# Altium project ec200u new design.PrjPcb
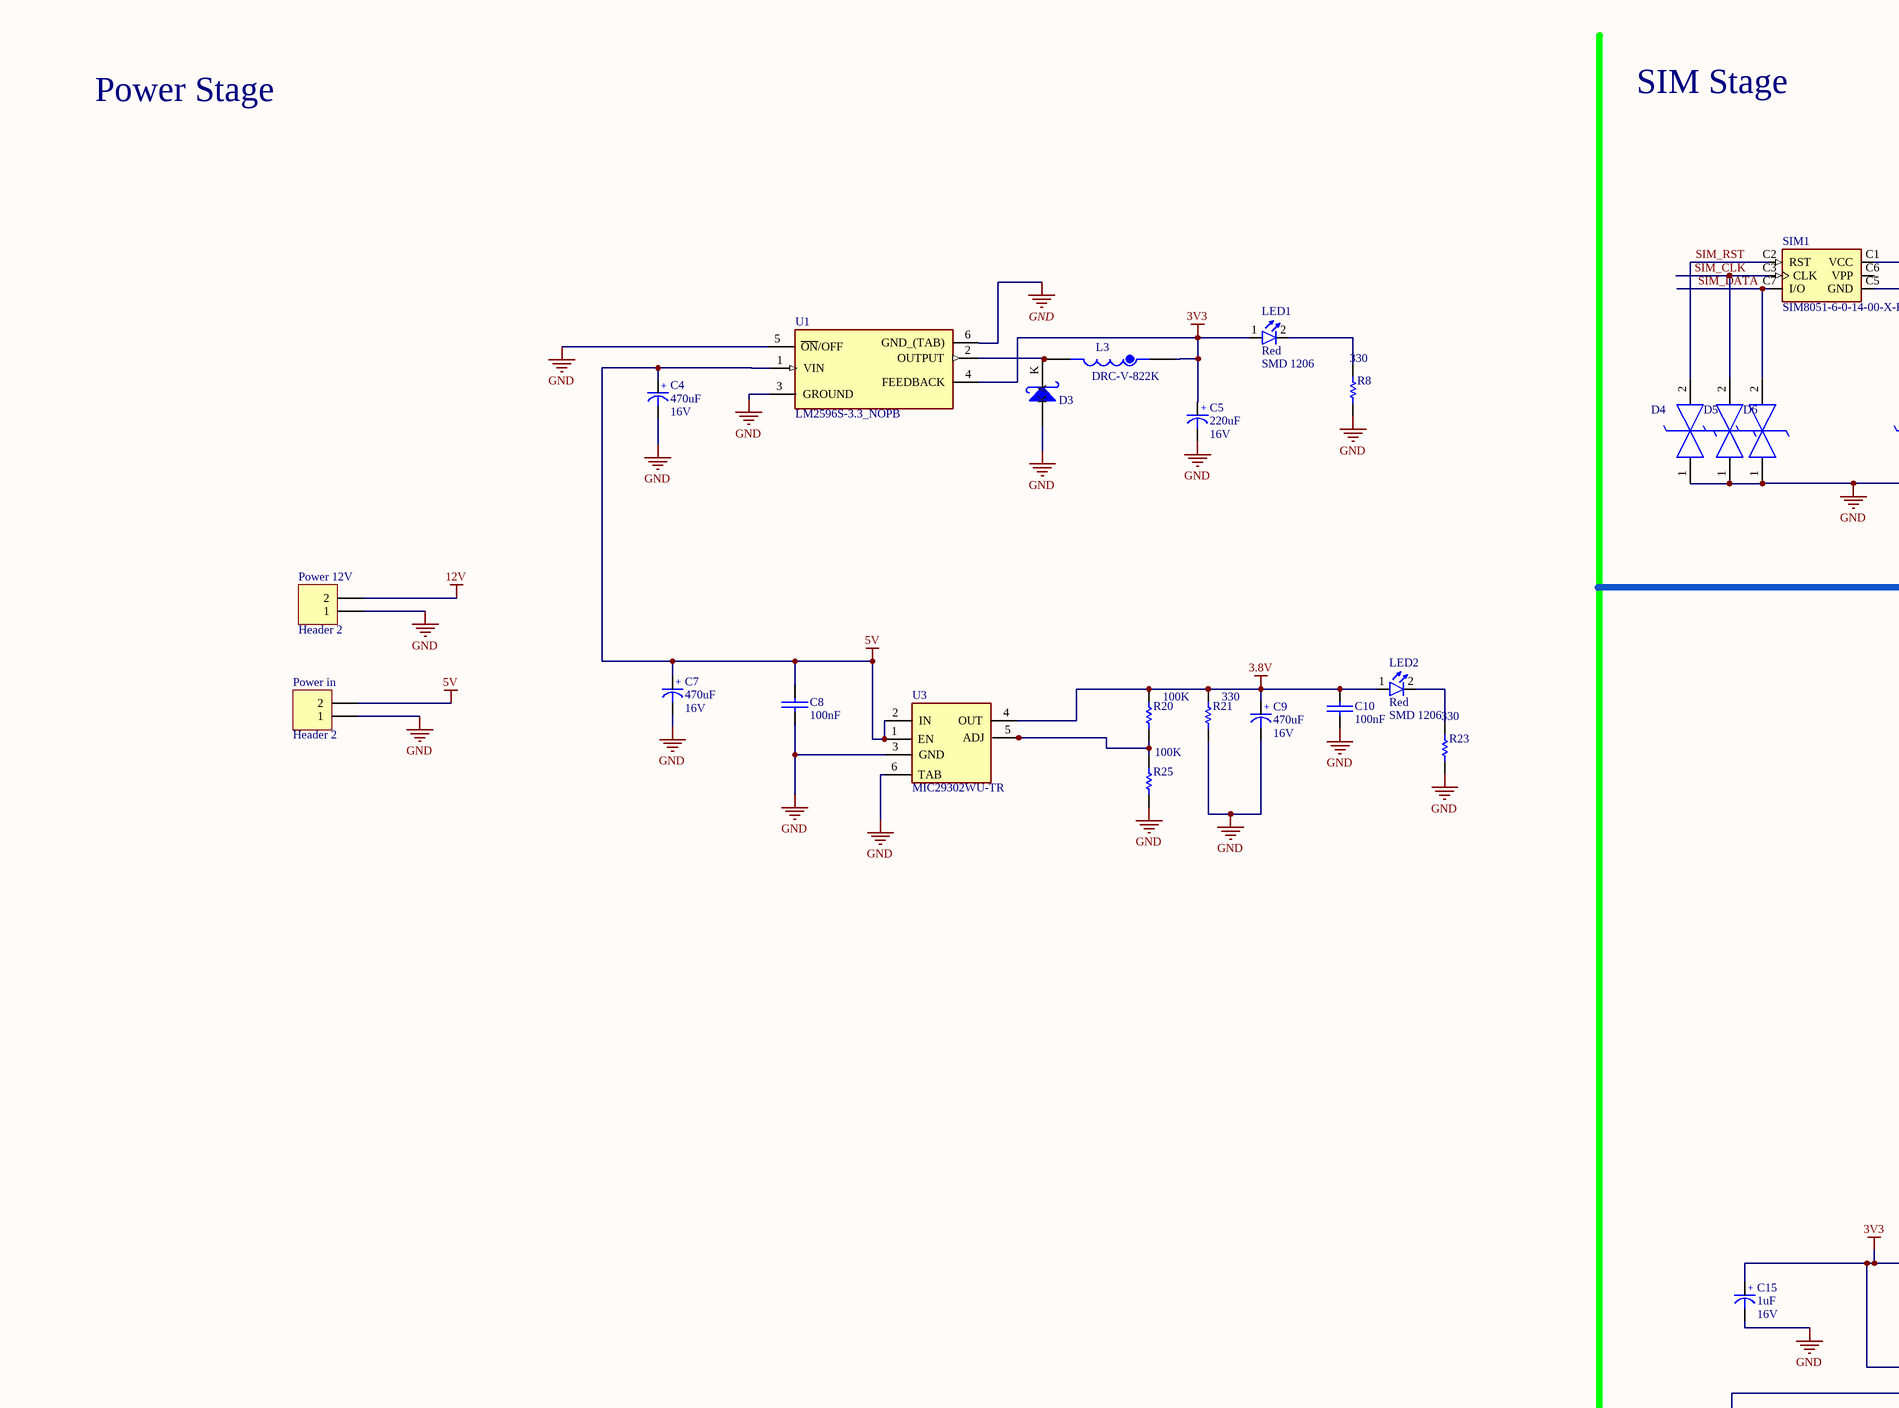
[diagram p0: ec200u main.SchDoc, top left]
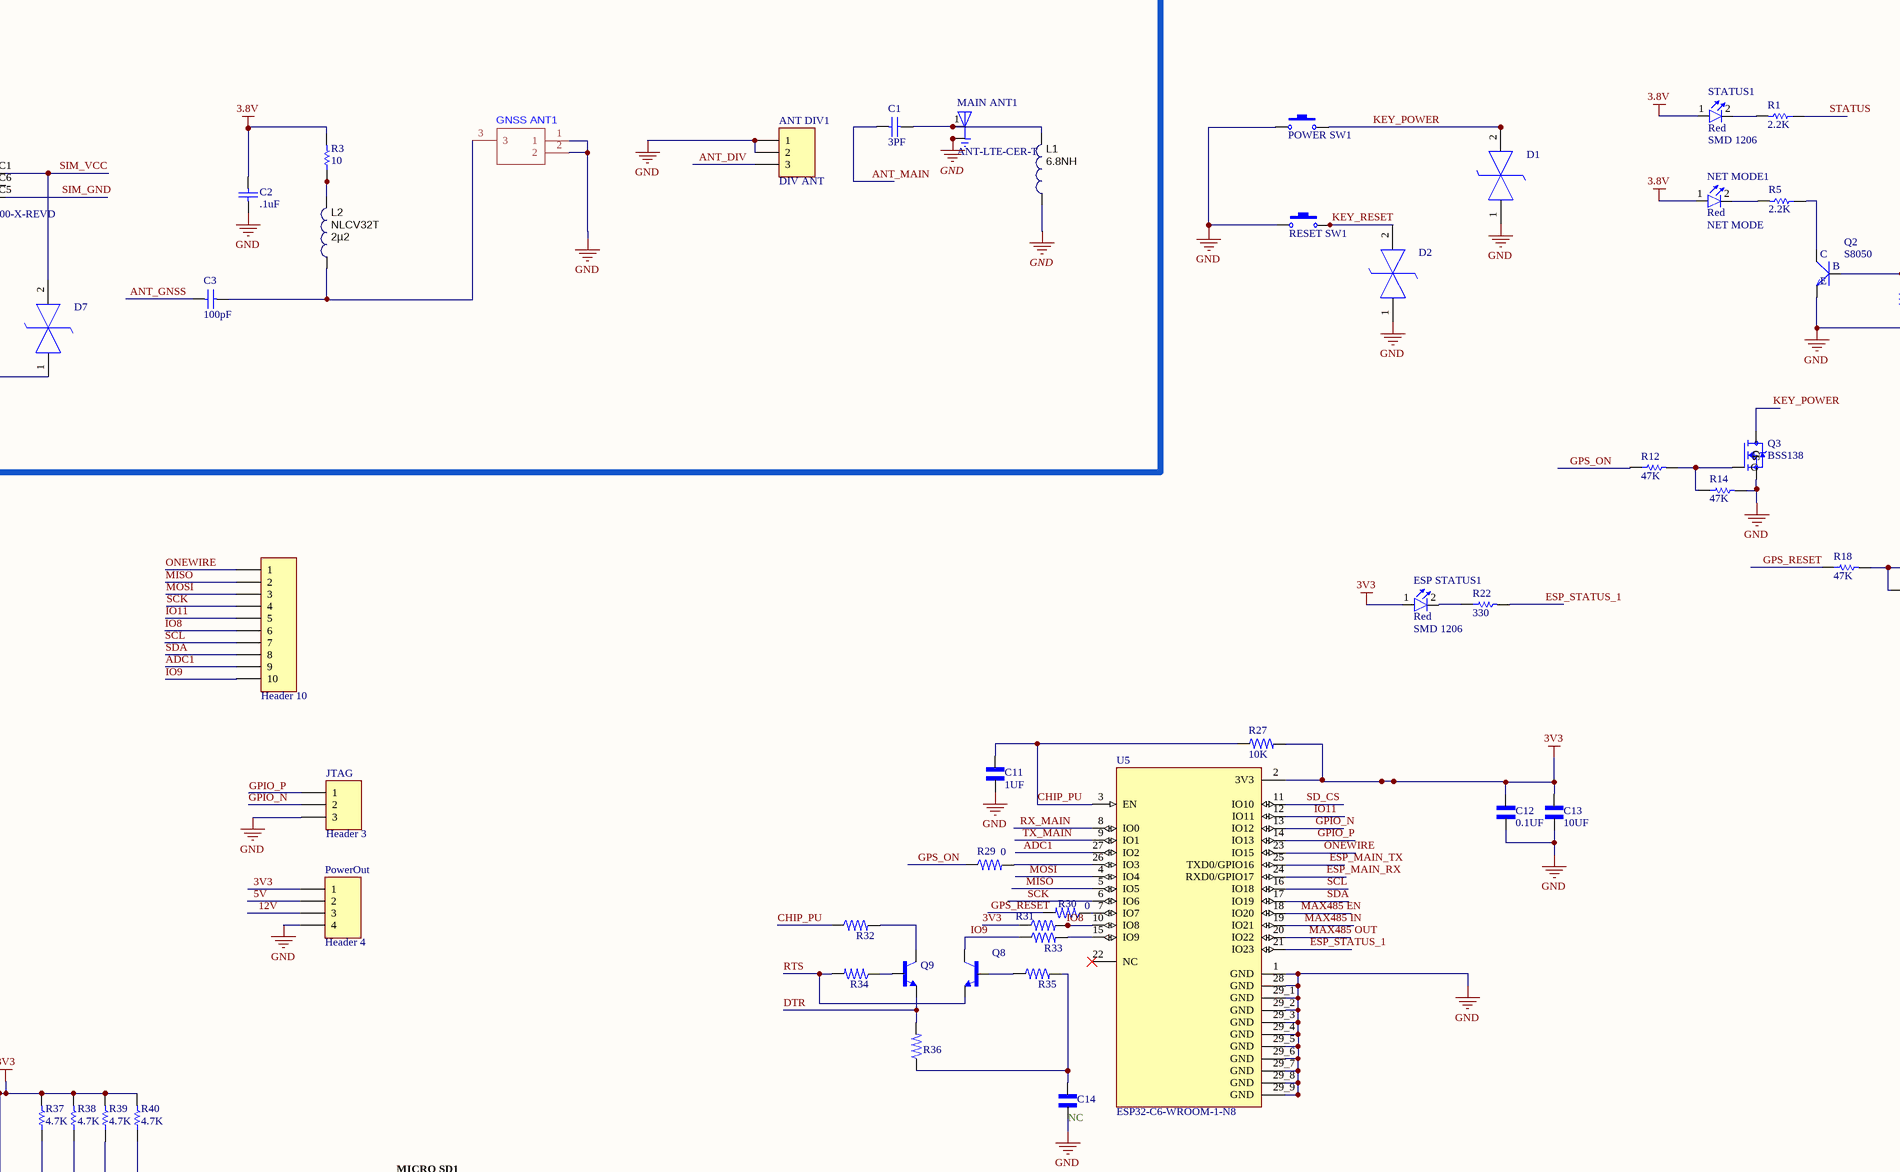
[diagram p1: ec200u main.SchDoc, top middle]
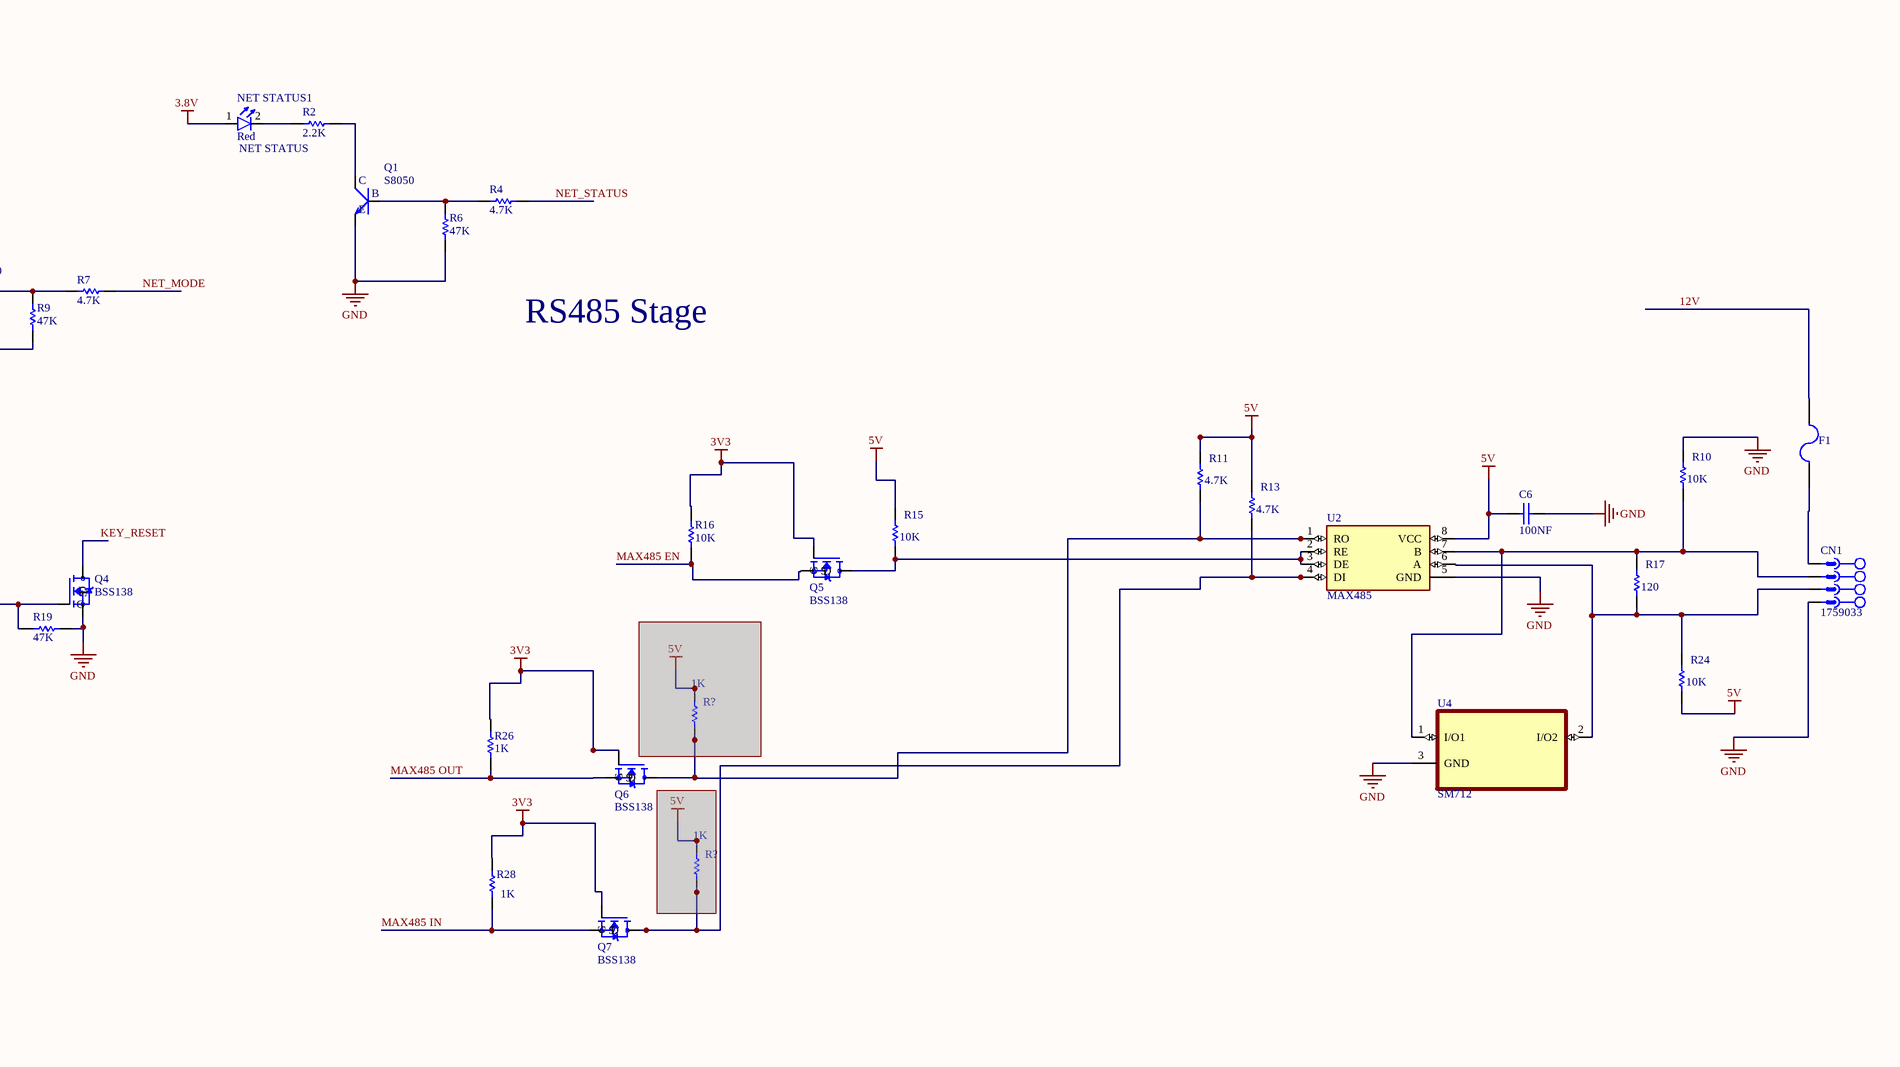
[diagram p2: ec200u main.SchDoc, top right]
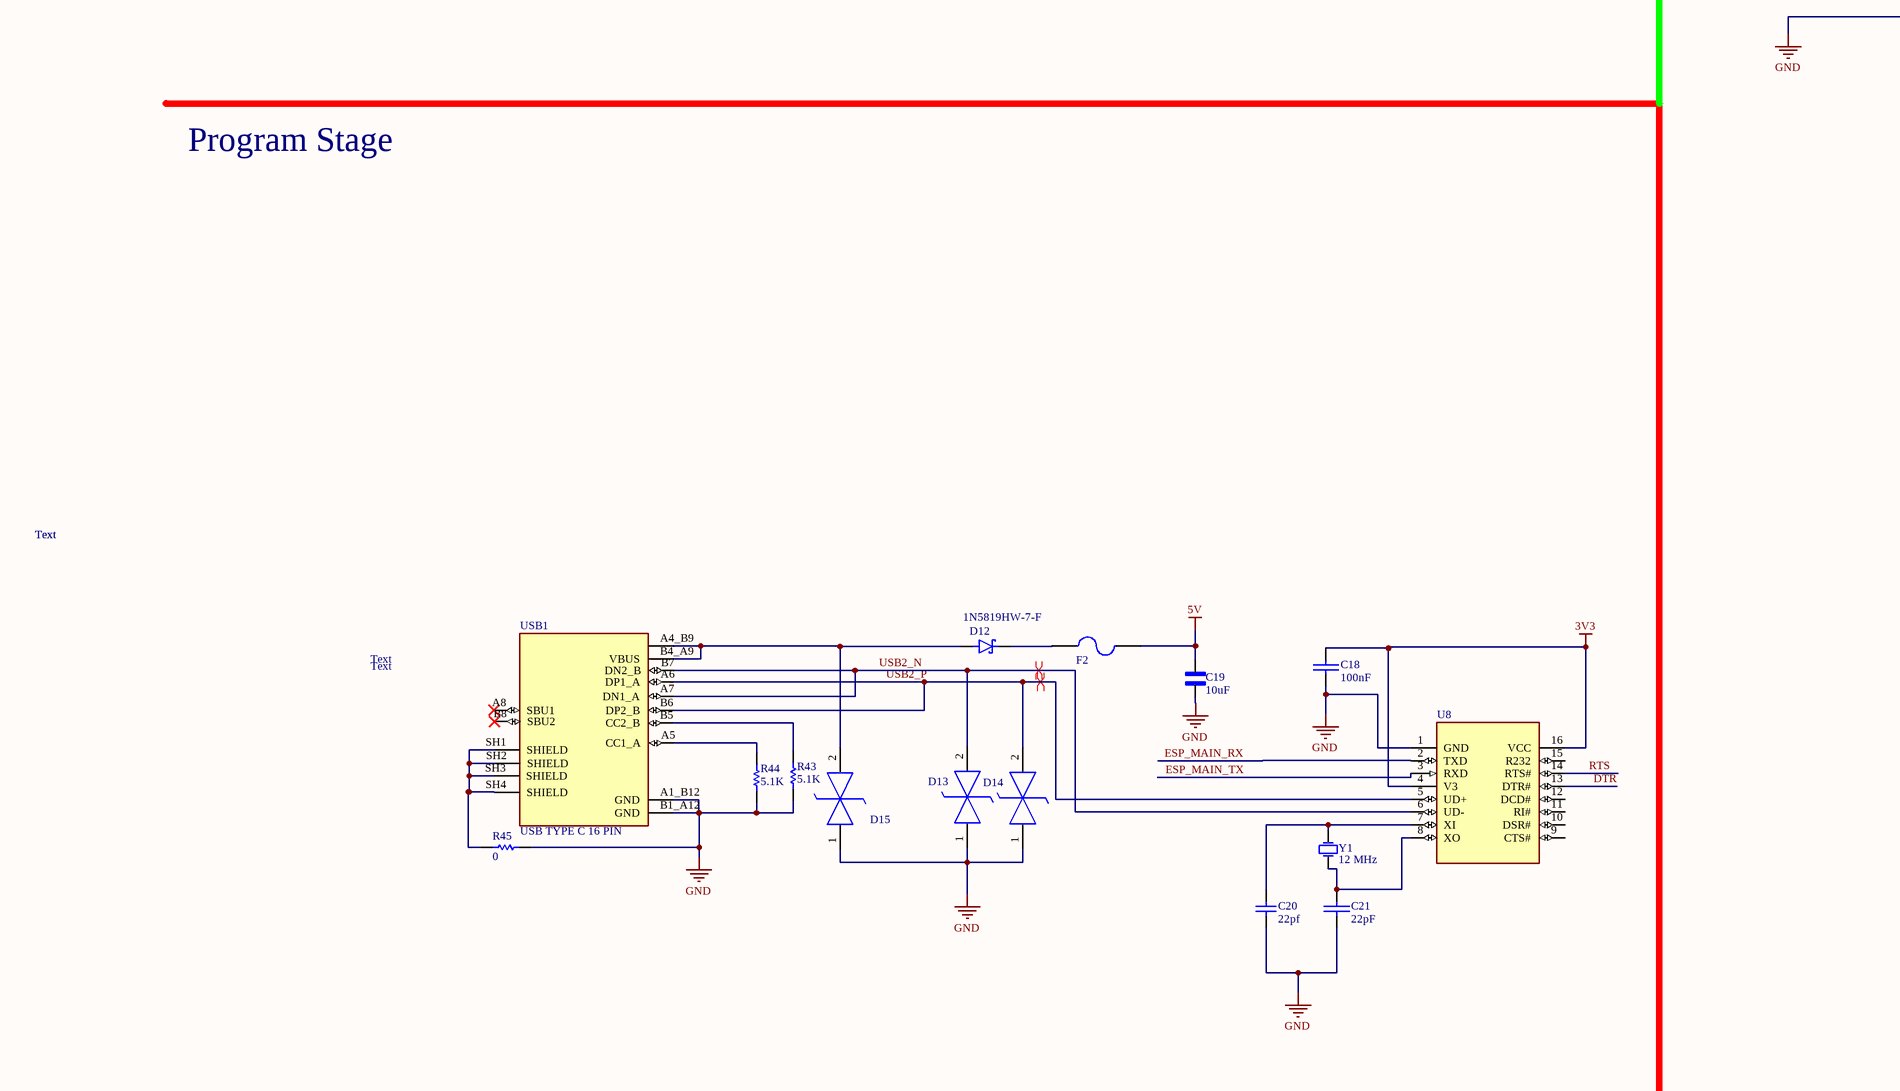
[diagram p3: ec200u main.SchDoc, centre left]
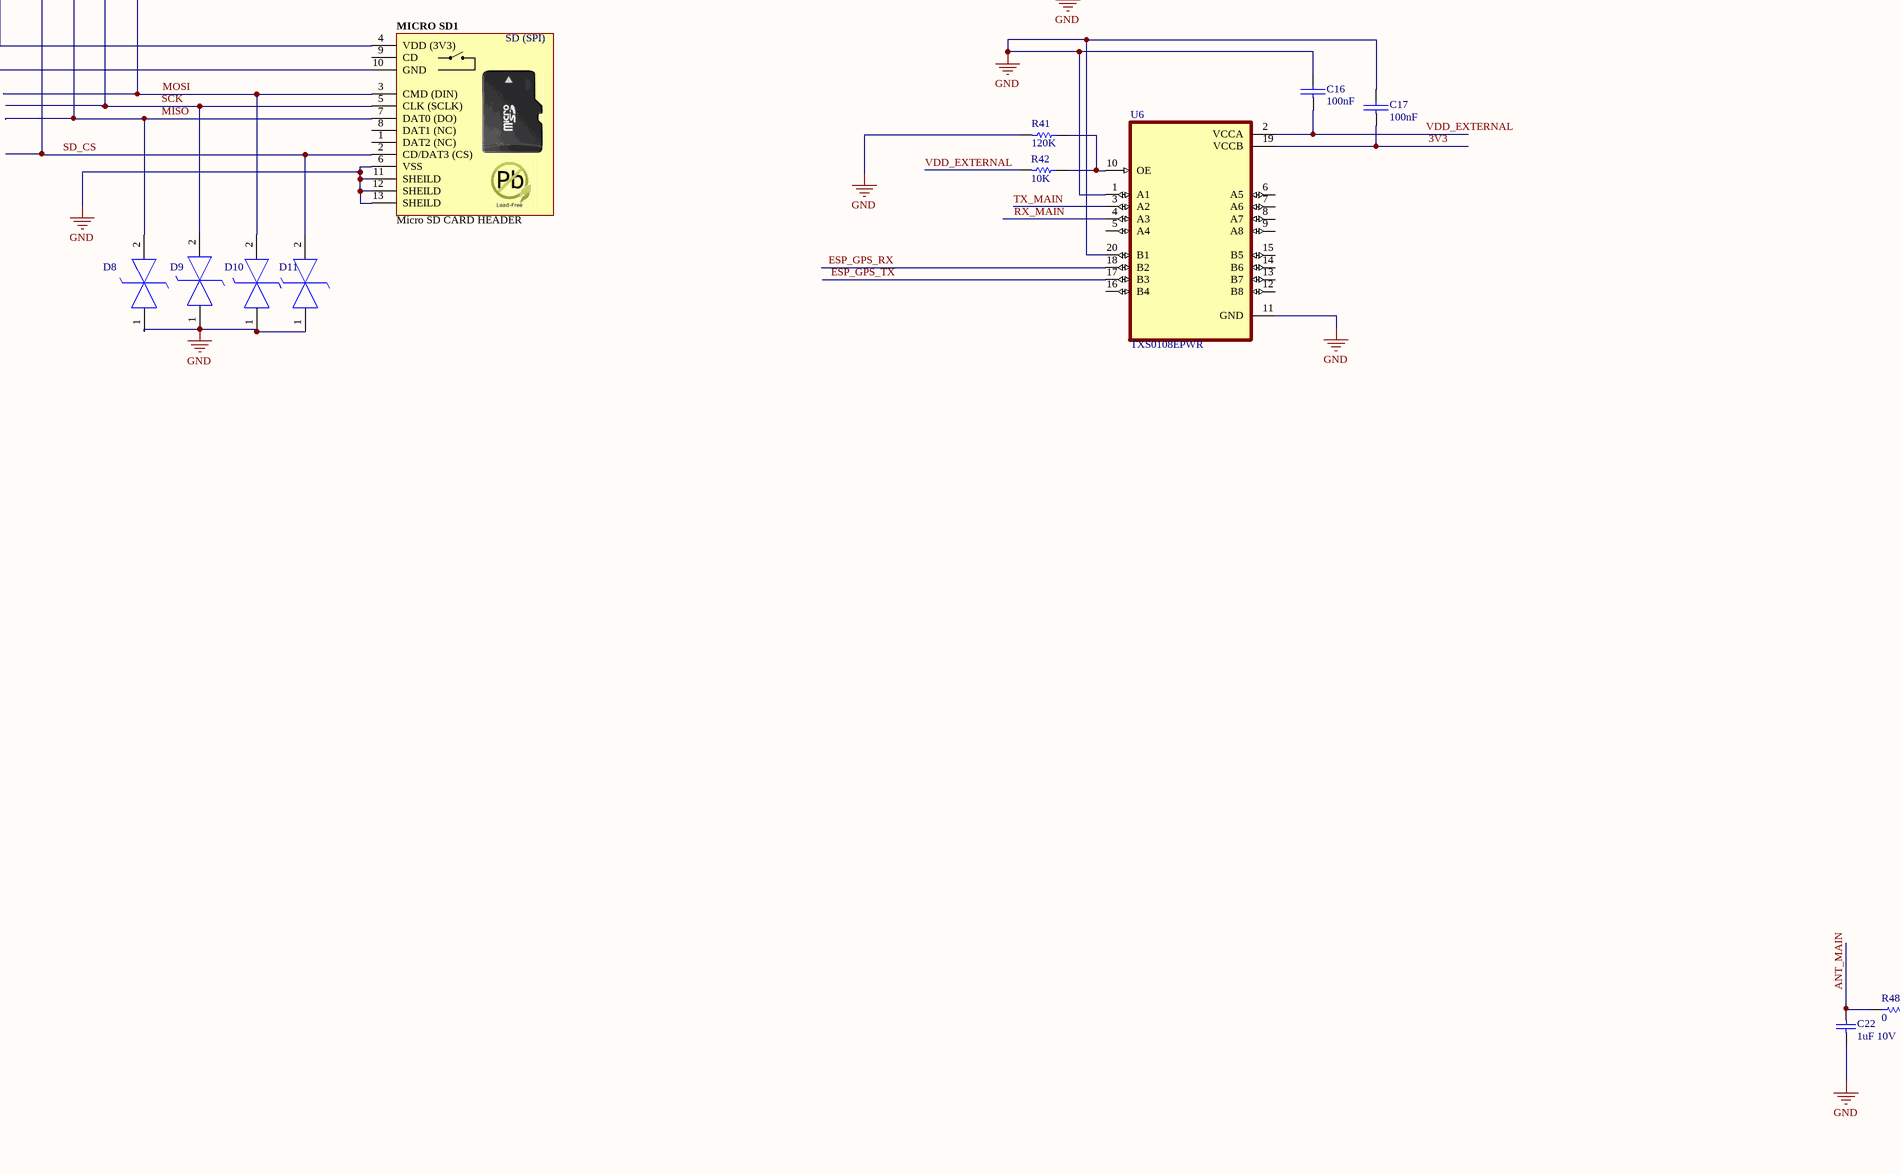
[diagram p4: ec200u main.SchDoc, centre middle]
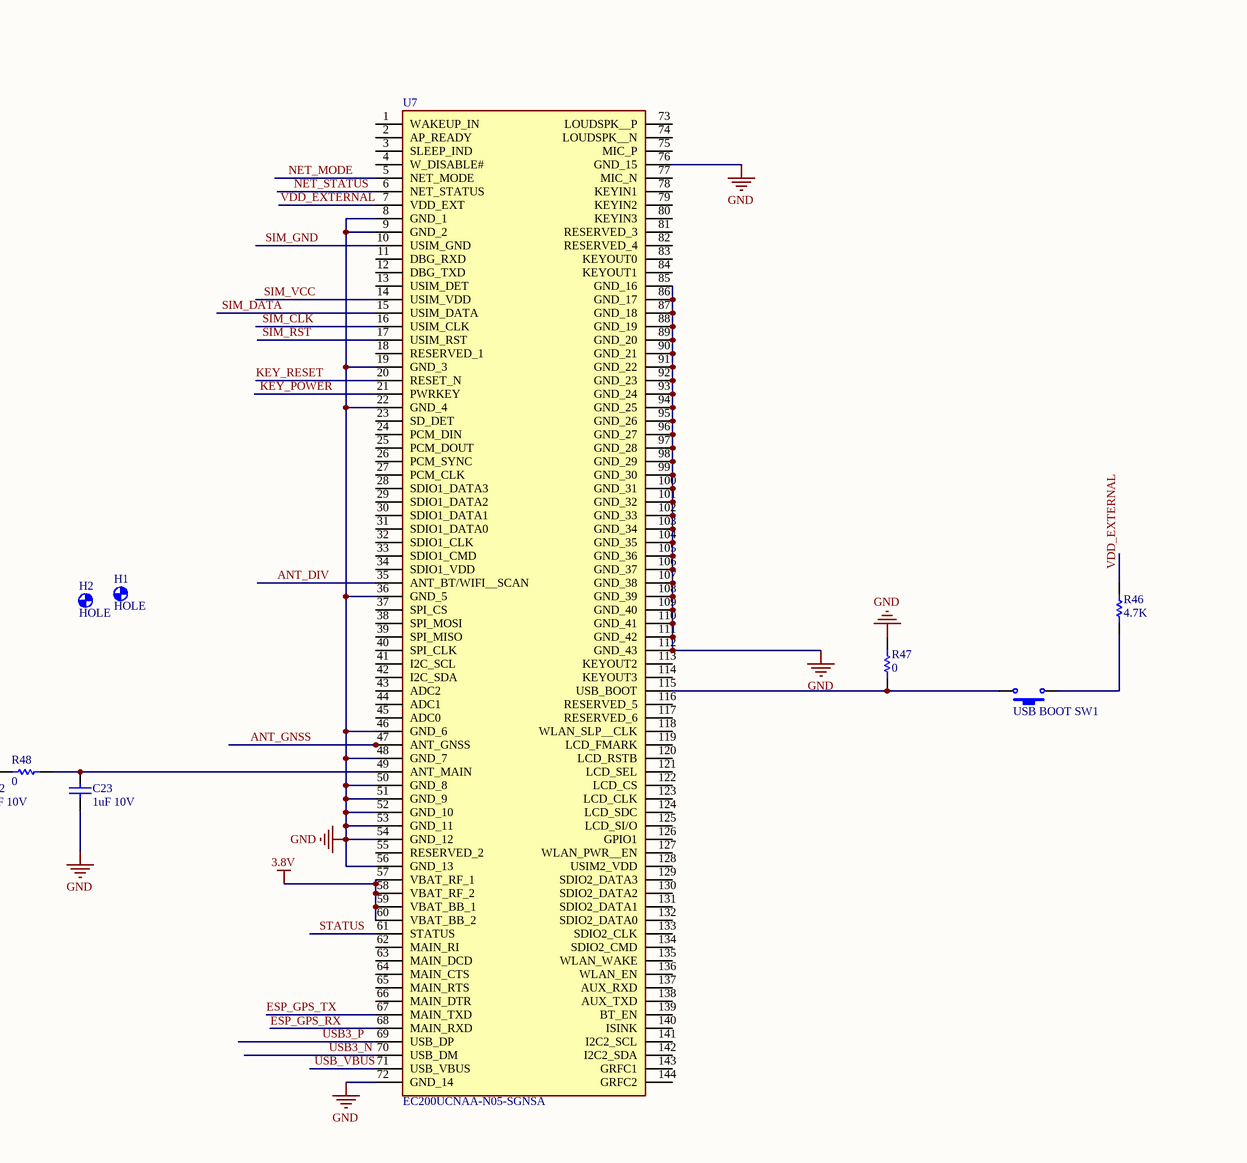
[diagram p5: ec200u main.SchDoc, centre right]
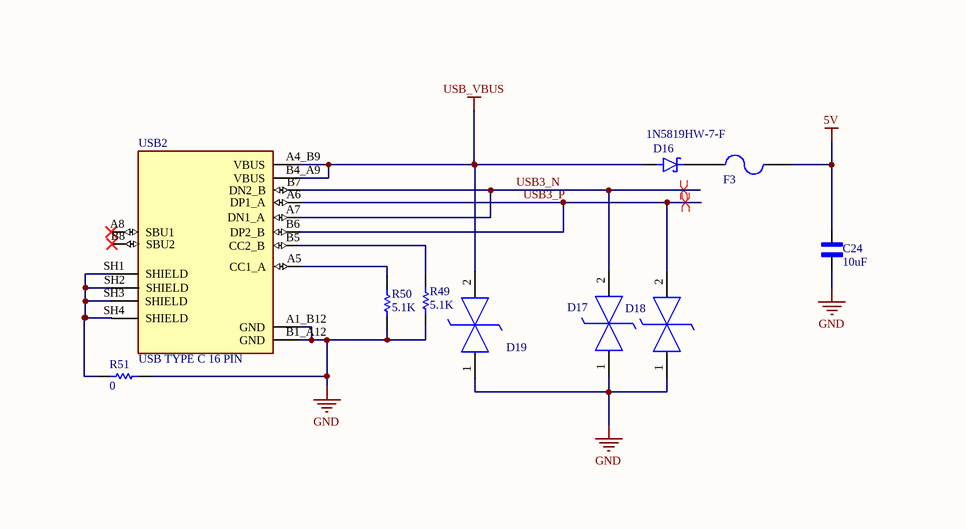
[diagram p6: ec200u main.SchDoc, bottom middle]
1 sheet, 144 parts. Net scope: global (net labels, ports and power ports of the same name join across sheets).
Board file: EC200U-PCB.PcbDoc

## Sheet ec200u main.SchDoc
size A0; SheetNumber: 1; SheetTotal: 1; SPICEModelCacheFMWMLOOX: <root> / <DocumentId>FMWMLOOX</DocumentId> / </root>

### Parts
(Parts that share a designator on the sheet are numbered #1, #2 ... from top to bottom, then left to right.)
ANT_DIV1  DIV ANT  [HDR1X3]
C1  3PF  [CAPC2012X140N]
C2  .1uF  [CAPC2012X140N]
C3  100pF  [CAPC2012X140N]
C4  Voltage: 16V  [CAP_EEEFN1C471P]  (hidden comment: 470uF)
C5  Voltage: 16V  [CAP_EEEFT1C221AL]  (hidden comment: 220uF)
C6  100NF  [CAPC2012X140N]
C7  Voltage: 16V  [CAP_EEEFN1C471P]  (hidden comment: 470uF)
C8  100nF  [CAPC2012X140N]
C9  Voltage: 16V  [CAP_EEEFN1C471P]  (hidden comment: 470uF)
C10  100nF  [CAPC2012X140N]
C11  1UF  [CAPC2012X140N]
C12  0.1UF  [CAPC2012X140N]
C13  10UF  [CAPPC3528X210N]
C14  (no value)  [CAPC2012X140N]
C15  Voltage: 16V  [CAP_EEEFN1H100UR]  (hidden comment: 1uF)
C16  100nF  [CAPC2012X140N]
C17  100nF  [CAPC2012X140N]
C18  100nF  [CAPC2012X140N]
C19  10uF  [CAPPC3528X210N]
C20  22pf  [CAPC2012X140N]
C21  22pF  [CAPC2012X140N]
C22  1uF 10V  [CAPC2012X140N]
C23  1uF 10V  [CAPC2012X140N]
C24  10uF  [CAPPC3528X210N]
CN1  1759033  [PCBComponent_1]
D1  PESD5V0S1BL,315  [DIO_PESD5V0S1UL,315]  (value not drawn)
D2  PESD5V0S1BL,315  [DIO_PESD5V0S1UL,315]  (value not drawn)
D3  1n5822  [PCBComponent_1]  (value not drawn)
D4  PESD5V0S1BL,315  [DIO_PESD5V0S1UL,315]  (value not drawn)
D5  PESD5V0S1BL,315  [DIO_PESD5V0S1UL,315]  (value not drawn)
D6  PESD5V0S1BL,315  [DIO_PESD5V0S1UL,315]  (value not drawn)
D7  PESD5V0S1BL,315  [DIO_PESD5V0S1UL,315]  (value not drawn)
D8  PESD5V0S1BL,315  [DIO_PESD5V0S1UL,315]  (value not drawn)
D9  PESD5V0S1BL,315  [DIO_PESD5V0S1UL,315]  (value not drawn)
D10  PESD5V0S1BL,315  [DIO_PESD5V0S1UL,315]  (value not drawn)
D11  PESD5V0S1BL,315  [DIO_PESD5V0S1UL,315]  (value not drawn)
D12  1N5819HW-7-F  [SOD3715X145N]
D13  PESD5V0S1BL,315  [DIO_PESD5V0S1UL,315]  (value not drawn)
D14  PESD5V0S1BL,315  [DIO_PESD5V0S1UL,315]  (value not drawn)
D15  PESD5V0S1BL,315  [DIO_PESD5V0S1UL,315]  (value not drawn)
D16  1N5819HW-7-F  [SOD3715X145N]
D17  PESD5V0S1BL,315  [DIO_PESD5V0S1UL,315]  (value not drawn)
D18  PESD5V0S1BL,315  [DIO_PESD5V0S1UL,315]  (value not drawn)
D19  PESD5V0S1BL,315  [DIO_PESD5V0S1UL,315]  (value not drawn)
ESP_STATUS1  Size: SMD 1206  [PCBComponent_1]  (hidden comment: Red)
F1  F=4A  [RESC3216X125N]  (value not drawn)
F2  F=1.0 A  [RESC3216X125N]  (value not drawn)
F3  F=1.0 A  [RESC3216X125N]  (value not drawn)
GNSS_ANT1  U.FL-R-SMT-1_01_  [PCBComponent_1]  (value not drawn)
H1  HOLE  [P3.0]  (no BOM)
H2  HOLE  [P3.0]  (no BOM)
I/O  Header 10  [HDR1X10]
JTAG  Header 3  [HDR1X3]
L1  6.8NH  [INDM3225X240N]
L2  NLCV32T  value 2µ2  [INDM3225X240N]
L3  DRC-V-822K  [IND_DRC-V-821K]
LED1  Size: SMD 1206  [PCBComponent_1]  (hidden comment: Red)
LED2  Size: SMD 1206  [PCBComponent_1]  (hidden comment: Red)
MAIN_ANT1  ANT-LTE-CER-T  [XDCR_ANT-LTE-CER-T]
MICRO_SD1  Micro SD CARD HEADER  [AMPHENOL_GTFP08131Y2HR]
NET_MODE1  Size: NET MODE  [PCBComponent_1]  (hidden comment: Red)
NET_STATUS1  Size: NET STATUS  [PCBComponent_1]  (hidden comment: Red)
Power_12V  Header 2  [HDR1X2]
Power_in  Header 2  [HDR1X2]
POWER_SW1  Switch PB  [PCBComponent_1]  (value not drawn)
PowerOut  Header 4  [HDR1X4]
Q1  S8050  [TRANS_SS8050-G]
Q2  S8050  [TRANS_SS8050-G]
Q3  BSS138  [SOT-23-3_L2.9-W1.3-P1.90-LS2.4-BR]
Q4  BSS138  [SOT-23-3_L2.9-W1.3-P1.90-LS2.4-BR]
Q5  BSS138  [SOT-23-3_L2.9-W1.3-P1.90-LS2.4-BR]
Q6  BSS138  [SOT-23-3_L2.9-W1.3-P1.90-LS2.4-BR]
Q7  BSS138  [SOT-23-3_L2.9-W1.3-P1.90-LS2.4-BR]
Q8  BC847B  [TRANS_BC847B]  (value not drawn)
Q9  BC847B  [TRANS_BC847B]  (value not drawn)
R1  2.2K  [RESC2012X65N]
R2  2.2K  [RESC2012X65N]
R3  10  [RESC2012X65N]
R4  4.7K  [RESC2012X65N]
R5  2.2K  [RESC2012X65N]
R6  47K  [RESC2012X65N]
R7  4.7K  [RESC2012X65N]
R8  330  [RESC2012X65N]
R9  47K  [RESC2012X65N]
R10  10K  [RESC2012X65N]
R11  4.7K  [RESC2012X65N]
R12  47K  [RESC2012X65N]
R13  4.7K  [RESC2012X65N]
R14  47K  [RESC2012X65N]
R15  10K  [RESC2012X65N]
R16  10K  [RESC2012X65N]
R17  120  [RESC2012X65N]
R18  47K  [RESC2012X65N]
R19  47K  [RESC2012X65N]
R20  100K  [RESC2012X65N]
R21  330  [RESC2012X65N]
R22  330  [RESC2012X65N]
R23  330  [RESC2012X65N]
R24  10K  [RESC2012X65N]
R25  100K  [RESC2012X65N]
R26  1K  [RESC2012X65N]
R27  10K  [RESC2012X65N]
R28  1K  [RESC2012X65N]
R29  0  [RESC2012X65N]
R30  0  [RESC2012X65N]
R31  3.3K  [RESC2012X65N]  (value not drawn)
R32  0  [RESC2012X65N]  (value not drawn)
R33  0  [RESC2012X65N]  (value not drawn)
R34  10K  [RESC2012X65N]  (value not drawn)
R35  0  [RESC2012X65N]  (value not drawn)
R36  10K  [RESC2012X65N]  (value not drawn)
R37  4.7K  [RESC2012X65N]
R38  4.7K  [RESC2012X65N]
R39  4.7K  [RESC2012X65N]
R40  4.7K  [RESC2012X65N]
R41  120K  [RESC2012X65N]
R42  10K  [RESC2012X65N]
R43  5.1K  [RESC2012X65N]
R44  5.1K  [RESC2012X65N]
R45  0  [RESC2012X65N]
R46  4.7K  [RESC2012X65N]
R47  0  [RESC2012X65N]
R48  0  [RESC2012X65N]
R49  5.1K  [RESC2012X65N]
R50  5.1K  [RESC2012X65N]
R51  0  [RESC2012X65N]
R?#1  1K  [1206]  (masked out: inside a compile mask, not in the netlist)
R?#2  1K  [1206]  (masked out: inside a compile mask, not in the netlist)
RESET_SW1  Switch PB  [PCBComponent_1]  (value not drawn)
SIM1  SIM8051-6-0-14-00-X-REVD  [PCBComponent_1]
STATUS1  Size: SMD 1206  [PCBComponent_1]  (hidden comment: Red)
U1  LM2596S-3.3_NOPB  [TO170P1435X465-6N]
U2  MAX485  [SOIC127P600X175-8N]
U3  MIC29302WU-TR  [MIC29302WUTR]
U4  SM712  [SOT23]
U5  ESP32-C6-WROOM-1-N8  [XCVR_ESP32-C6-WROOM-1-N8]
U6  TXS0108EPWR  [SOP65P640X120-20N]
U7  EC200UCNAA-N05-SGNSA  [EC200UCNAAN05SGNSA]
U8  (no value)  [SO16_M]
USB1  USB TYPE C 16 PIN  [AMPHENOL_10155435-00011LF]
USB2  USB TYPE C 16 PIN  [AMPHENOL_10155435-00011LF]
USB_BOOT_SW1  Switch PB  [PCBComponent_1]  (value not drawn)
Y1  12 MHz  [PCBComponent_1]

### Nets
3.8V: C2.2 C9.1(+) C10.2(-) LED2.1(A) NET_MODE1.1(A) NET_STATUS1.1(A) R3.2 R20.2 R21.2 STATUS1.1(A) U3.4(OUT) U7.57(VBAT_RF_1) U7.58(VBAT_RF_2) U7.59(VBAT_BB_1) U7.60(VBAT_BB_2)
3V3: C5.1(+) C12.1 C13.1 C15.1(+) C17.2(-) C18.2(-) ESP_STATUS1.1(A) L3.1 LED1.1(A) MICRO_SD1.4(VDD_(3V3)) PowerOut.1 Q5.1(G) Q6.1(G) Q7.1(G) R16.1 R26.1 R27.2 R28.1 R31.1 R37.2 R38.2 R39.2 R40.2 U1.4(FEEDBACK) U5.2(3V3) U6.19(VCCB) U8.4(V3) U8.16(VCC)
5V: C4.1(+) C6.2 C7.1(+) C8.2(-) C19.2 C24.2 F2.2 F3.2 Power_in.2 PowerOut.2 R11.1 R13.1 R15.1 R24.2 U1.1(VIN) U2.8(VCC) U3.1(EN) U3.2(IN)
12V: F1.2 Power_12V.2 PowerOut.3
GND: ANT_DIV1.1 ANT_DIV1.2 C2.1 C4.2(-) C5.2(-) C6.1 C7.2(-) C8.1(+) C9.2(-) C10.1(+) C11.2 C12.2 C13.2 C14.2 C15.2(-) C16.1(+) C17.1(+) C18.1(+) C19.1 C20.2(-) C21.1(+) C22.1 C23.1 C24.1 CN1.4 D1.1(K1) D2.1(K1) D3.A D4.1(K1) D5.1(K1) D6.1(K1) D7.1(K1) D8.1(K1) D9.1(K1) D10.1(K1) D11.1(K1) D13.1(K1) D14.1(K1) D15.1(K1) D17.1(K1) D18.1(K1) D19.1(K1) GNSS_ANT1.1 GNSS_ANT1.2 JTAG.3 L1.1 MAIN_ANT1.2(GND) MAIN_ANT1.3(GND) MICRO_SD1.6(VSS) MICRO_SD1.10(GND) MICRO_SD1.11(SHEILD) MICRO_SD1.12(SHEILD) MICRO_SD1.13(SHEILD) Power_12V.1 Power_in.1 POWER_SW1.1 PowerOut.4 Q1.2(E) Q2.2(E) Q3.2(S) Q4.2(S) R6.2 R8.1 R9.2 R10.1 R14.2 R19.2 R21.1 R23.1 R25.1 R41.2 R43.1 R44.2 R45.2 R47.1 R49.1 R50.2 R51.2 RESET_SW1.1 U1.3(GROUND) U1.5(~{ON}/OFF) U1.6(GND_(TAB)) U2.5(GND) U3.3(GND) U3.6(TAB) U4.3(GND) U5.1(GND) U5.28(GND) U5.29_1(GND) U5.29_2(GND) U5.29_3(GND) U5.29_4(GND) U5.29_5(GND) U5.29_6(GND) U5.29_7(GND) U5.29_8(GND) U5.29_9(GND) U6.1(A1) U6.11(GND) U6.20(B1) U7.8(GND_1) U7.9(GND_2) U7.19(GND_3) U7.22(GND_4) U7.36(GND_5) U7.46(GND_6) U7.48(GND_7) U7.50(GND_8) U7.51(GND_9) U7.52(GND_10) U7.53(GND_11) U7.54(GND_12) U7.56(GND_13) U7.72(GND_14) U7.76(GND_15) U7.85(GND_16) U7.86(GND_17) U7.87(GND_18) U7.88(GND_19) U7.89(GND_20) U7.90(GND_21) U7.91(GND_22) U7.92(GND_23) U7.93(GND_24) U7.94(GND_25) U7.95(GND_26) U7.96(GND_27) U7.97(GND_28) U7.98(GND_29) U7.99(GND_30) U7.100(GND_31) U7.101(GND_32) U7.102(GND_33) U7.103(GND_34) U7.104(GND_35) U7.105(GND_36) U7.106(GND_37) U7.107(GND_38) U7.108(GND_39) U7.109(GND_40) U7.110(GND_41) U7.111(GND_42) U7.112(GND_43) U8.1(GND) USB1.A1_B12(GND) USB1.B1_A12(GND) USB2.A1_B12(GND) USB2.B1_A12(GND)
USB_VBUS: D16.A D19.2(K2) U7.71(USB_VBUS) USB2.A4_B9(VBUS) USB2.B4_A9(VBUS)
ADC1: I/O.9 U5.27(IO2)
ANT_DIV: ANT_DIV1.3 U7.35(ANT_BT/WIFI__SCAN)
ANT_GNSS: C3.1 U7.47(ANT_GNSS)
ANT_MAIN: C1.2 C22.2 R48.1
CHIP_PU: C11.1 R27.1 R32.1 U5.3(EN)
DTR: Q9.2(E) R36.2 U8.13(DTR#)
ESP_GPS_RX: U6.18(B2) U7.68(MAIN_RXD)
ESP_GPS_TX: U6.17(B3) U7.67(MAIN_TXD)
ESP_MAIN_RX: U5.24(RXD0/GPIO17) U8.2(TXD)
ESP_MAIN_TX: U5.25(TXD0/GPIO16) U8.3(RXD)
ESP_STATUS_1: R22.2 U5.21(IO23)
GPIO_N: JTAG.2 U5.13(IO12)
GPIO_P: JTAG.1 U5.14(IO13)
GPS_ON: R12.1 R29.1
GPS_RESET: R18.1 R30.2
IO8: I/O.6 R31.2 U5.10(IO8)
IO9: I/O.10 Q8.3(C) R33.1
IO11: I/O.5 U5.12(IO11)
KEY_POWER: D1.2(K2) POWER_SW1.2 Q3.3(D) U7.21(PWRKEY)
KEY_RESET: D2.2(K2) Q4.3(D) RESET_SW1.2 U7.20(RESET_N)
MAX485 EN: Q5.2(S) R16.2 U5.18(IO20)
MAX485 IN: Q7.2(S) R28.2 U5.19(IO21)
MAX485 OUT: Q6.2(S) R26.2 U5.20(IO22)
MISO: D8.2(K2) I/O.2 MICRO_SD1.7(DAT0_(DO)) R38.1 U5.5(IO5)
MOSI: D10.2(K2) I/O.3 MICRO_SD1.3(CMD_(DIN)) R40.1 U5.4(IO4)
NET_MODE: R7.1 U7.5(NET_MODE)
NET_STATUS: R4.1 U7.6(NET_STATUS)
ONEWIRE: I/O.1 U5.23(IO15)
RTS: Q8.2(E) R34.2 U8.14(RTS#)
RX_MAIN: U5.8(IO0) U6.4(A3)
SCK: D9.2(K2) I/O.4 MICRO_SD1.5(CLK_(SCLK)) R39.1 U5.6(IO6)
SCL: I/O.7 U5.16(IO18)
SD_CS: D11.2(K2) MICRO_SD1.2(CD/DAT3_(CS)) R37.1 U5.11(IO10)
SDA: I/O.8 U5.17(IO19)
SIM_CLK: D5.2(K2) SIM1.C3(CLK) U7.16(USIM_CLK)
SIM_DATA: D6.2(K2) SIM1.C7(I/O) U7.15(USIM_DATA)
SIM_GND: SIM1.C5(GND) U7.10(USIM_GND)
SIM_RST: D4.2(K2) SIM1.C2(RST) U7.17(USIM_RST)
SIM_VCC: D7.2(K2) SIM1.C1(VCC) U7.14(USIM_VDD)
STATUS: R1.1 U7.61(STATUS)
TX_MAIN: U5.9(IO1) U6.3(A2)
USB2_N: D13.2(K2) U8.6(UD-) USB1.A7(DN1_A) USB1.B7(DN2_B)
USB2_P: D14.2(K2) U8.5(UD+) USB1.A6(DP1_A) USB1.B6(DP2_B)
USB3_N: D17.2(K2) U7.70(USB_DM) USB2.A7(DN1_A) USB2.B7(DN2_B)
USB3_P: D18.2(K2) U7.69(USB_DP) USB2.A6(DP1_A) USB2.B6(DP2_B)
VDD_EXTERNAL: C16.2(-) R42.2 R46.1 U6.2(VCCA) U7.7(VDD_EXT)
NetC1_1: C1.1 L1.2 MAIN_ANT1.1(FEEDING)
NetC3_2: C3.2 GNSS_ANT1.3 L2.1
NetC14_1: C14.1 R35.2 R36.1
NetC20_1: C20.1(+) U8.7(XI) Y1.2(OSC2)
NetC21_2: C21.2(-) U8.8(XO) Y1.1(OSC1)
NetC23_2: C23.2 R48.2 U7.49(ANT_MAIN)
NetCN1_1: CN1.1 F1.1
NetCN1_2: CN1.2 R10.2 R17.1 U2.7(B) U4.1(I/O1)
NetCN1_3: CN1.3 R17.2 R24.1 U2.6(A) U4.2(I/O2)
NetD3_K: D3.K L3.2 U1.2(OUTPUT)
NetD12_A: D12.A D15.2(K2) USB1.A4_B9(VBUS) USB1.B4_A9(VBUS)
NetD12_C: D12.C(K) F2.1
NetD16_C: D16.C(K) F3.1
NetESP_STATUS1_2: ESP_STATUS1.2(K) R22.1
NetL2_2: L2.2 R3.1
NetLED1_2: LED1.2(K) R8.2
NetLED2_2: LED2.2(K) R23.2
NetNET_MODE1_2: NET_MODE1.2(K) R5.2
NetNET_STATUS1_2: NET_STATUS1.2(K) R2.2
NetQ1_1: Q1.1(B) R4.2 R6.1
NetQ1_3: Q1.3(C) R2.1
NetQ2_1: Q2.1(B) R7.2 R9.1
NetQ2_3: Q2.3(C) R5.1
NetQ3_1: Q3.1(G) R12.2 R14.1
NetQ4_1: Q4.1(G) R18.2 R19.1
NetQ5_3: Q5.3(D) R15.2 U2.2(RE) U2.3(DE)
NetQ6_3: Q6.3(D) R11.2 U2.1(RO)
NetQ7_3: Q7.3(D) R13.2 U2.4(DI)
NetQ8_1: Q8.1(B) R35.1
NetQ9_1: Q9.1(B) R34.1
NetQ9_3: Q9.3(C) R32.2
NetR1_2: R1.2 STATUS1.2(K)
NetR20_1: R20.1 R25.2 U3.5(ADJ)
NetR29_2: R29.2 U5.26(IO3)
NetR30_1: R30.1 U5.7(IO7)
NetR33_2: R33.2 U5.15(IO9)
NetR41_1: R41.1 R42.1 U6.10(OE)
NetR43_2: R43.2 USB1.B5(CC2_B)
NetR44_1: R44.1 USB1.A5(CC1_A)
NetR45_1: R45.1 USB1.SH1(SHIELD) USB1.SH2(SHIELD) USB1.SH3(SHIELD) USB1.SH4(SHIELD)
NetR46_2: R46.2 USB_BOOT_SW1.1
NetR47_2: R47.2 U7.115(USB_BOOT) USB_BOOT_SW1.2
NetR49_2: R49.2 USB2.B5(CC2_B)
NetR50_1: R50.1 USB2.A5(CC1_A)
NetR51_1: R51.1 USB2.SH1(SHIELD) USB2.SH2(SHIELD) USB2.SH3(SHIELD) USB2.SH4(SHIELD)

Not connected (* = marked no-connect by the designer): MICRO_SD1 1(DAT2_(NC)) 8(DAT1_(NC)) 9(CD); SIM1 C6(VPP); U5 22(NC)*; U6 5(A4) 6(A5) 7(A6) 8(A7) 9(A8) 12(B8) 13(B7) 14(B6) 15(B5) 16(B4); U7 1(WAKEUP_IN) 2(AP_READY) 3(SLEEP_IND) 4(W_DISABLE#) 11(DBG_RXD) 12(DBG_TXD) 13(USIM_DET) 18(RESERVED_1) 23(SD_DET) 24(PCM_DIN) 25(PCM_DOUT) 26(PCM_SYNC) 27(PCM_CLK) 28(SDIO1_DATA3) 29(SDIO1_DATA2) 30(SDIO1_DATA1) 31(SDIO1_DATA0) 32(SDIO1_CLK) 33(SDIO1_CMD) 34(SDIO1_VDD) 37(SPI_CS) 38(SPI_MOSI) 39(SPI_MISO) 40(SPI_CLK) 41(I2C_SCL) 42(I2C_SDA) 43(ADC2) 44(ADC1) 45(ADC0) 55(RESERVED_2) 62(MAIN_RI) 63(MAIN_DCD) 64(MAIN_CTS) 65(MAIN_RTS) 66(MAIN_DTR) 73(LOUDSPK__P) 74(LOUDSPK__N) 75(MIC_P) 77(MIC_N) 78(KEYIN1) 79(KEYIN2) 80(KEYIN3) 81(RESERVED_3) 82(RESERVED_4) 83(KEYOUT0) 84(KEYOUT1) 113(KEYOUT2) 114(KEYOUT3) 116(RESERVED_5) 117(RESERVED_6) 118(WLAN_SLP__CLK) 119(LCD_FMARK) 120(LCD_RSTB) 121(LCD_SEL) 122(LCD_CS) 123(LCD_CLK) 124(LCD_SDC) 125(LCD_SI/O) 126(GPIO1) 127(WLAN_PWR__EN) 128(USIM2_VDD) 129(SDIO2_DATA3) 130(SDIO2_DATA2) 131(SDIO2_DATA1) 132(SDIO2_DATA0) 133(SDIO2_CLK) 134(SDIO2_CMD) 135(WLAN_WAKE) 136(WLAN_EN) 137(AUX_RXD) 138(AUX_TXD) 139(BT_EN) 140(ISINK) 141(I2C2_SCL) 142(I2C2_SDA) 143(GRFC1) 144(GRFC2); U8 9(CTS#) 10(DSR#) 11(RI#) 12(DCD#) 15(R232); USB1 A8(SBU1)* B8(SBU2)*; USB2 A8(SBU1)* B8(SBU2)*

### Layout directives
differential pair: USB2_N, USB2_P, USB3_N, USB3_P

### Notes on the sheet
- Power Stage
- SIM Stage
- RS485 Stage
- (near C14) NC
- Program Stage
- Text
- (in symbol CON_Micro SD) SD (SPI)

### Library data of the parts
ANT_DIV1 JTAG = Header 3: Header, 3-Pin; LatestRevisionDate: 17-Jul-2002; LatestRevisionNote: Re-released for DXP Platform.; Publisher: Altium Limited
C1-C3 C6 = CAP SMD 1206: CAP 1206; Designer: Abbas Basereh; Desc.: CAP SMD 1206; Data: 16-12-2016
C4 C5 C7 C9 C15 = Cap-Polar: Polar Capacitor; Designer: Saeid Jorablo; Organazation: ControTec; Adding Date: 1387/12/20
  C4 C7 C9: Value: 470uF
  C5: Value: 220uF
  C15: Value: 1uF
C8 C10 C16-C18 C21 = Cap-Bipolar: Bipolar Capacitor; Voltage: 100V; Designer: Saeid Jorablo; Organazation: ControTec; Adding Date: 1387/12/20
  C8 C10 C16-C18: Value: 100nF
  C21: Value: 22pF
C11 C12 C14 = LD055A561FAB2A: T&R / COMMERCIAL CHIP; Package: None; Price: None; Value: *; MP: LD055A561FAB2A; Availability: Unavailable
C13 C19 C24 = TAJB106M025RNJ: 10ÂµF Molded Tantalum Capacitors 25V 1411 (3528 Metric), 1210 2.5Ohm; MF: AVX; MP: TAJB106M025RNJ; SnapEDA_Link: https://www.snapeda.com/parts/TAJB106M025RNJ/AVX/view-part/1682882/?ref=snap; Availability: Good; Arrow_Electronics-Purchase-URL: https://snapeda.com/shop?store=Arrow+Electronics&id=1682882; Mouser-Purchase-URL: https://snapeda.com/shop?store=Mouser&id=1682882; Package: 1210 AVX; Value: *; Price: None
C20 = CAP_Bipolar: Bipolar Capacitor; Voltage: 100V; Designer: Eng. Saeid Jorablo; Company: SJ Libraries; ComponentLink1Description: Datasheet; ComponentLink2Description: Reference; Publisher: SJ Unlimited; Mounting Technology: *; Mounting Technology: Surface Mount\Through-Hole; HelpURL: http://s3.picofile.com/file/7443264187/Coming_Soon_logo.gif; Status: Unreleased; Value: 22pf
C22 C23 = CAP SMD 1206: 10 V; Designer: Abbas Basereh; Desc.: CAP SMD 1206; Data: 16-12-2016
CN1 = CON_Phoenix_MSTB_04: 4 Pitch: 5.08 mm Color: green Contact surface: Tin Assembly; Manufacturer: PHOENIX CONTACT; Connector type: PCB Terminal Block; designer: ABBAS BASEREH; Max Current: 12 A; Positions: 4; Voltage: 320 V; Category: Connector; ComponentLink1Description: Header, Nominal current: 12 A Rated voltage (III/2): 320 V Number of positions: 4 Pitch: 5.08 mm Color: green Contact surface: Tin Assembly: Soldering  DESIGNER:ABBAS BASEREH; ComponentLink2Description: Reference; Mounting Technology: Through-Hole; Pin Count: 4; Revision 1: 2017-3-1; Status: Unreleased; PART.NO: 1759033
D1 D2 D4-D11 D13-D15 D17-D19 = PESD5V0S1BL,315: Diode ESD (Bi-directional); Manufacturer_Name: Nexperia; Datasheet Link: https://assets.nexperia.com/documents/data-sheet/PESD5V0S1BL.pdf; Height: 0mm; Manufacturer_Part_Number: PESD5V0S1BL,315; Mouser Part Number: 771-PESD5V0S1BL315; Mouser Price/Stock: https://www.mouser.co.uk/ProductDetail/Nexperia/PESD5V0S1BL315?qs=LOCUfHb8d9vNKhGKXkjrvQ%3D%3D; Arrow Part Number: PESD5V0S1BL,315; Arrow Price/Stock: https://www.arrow.com/en/products/pesd5v0s1bl315/nexperia
D3 = 1n5822 SMD: Schottky Rectifiers; Part. No: SS34; Manufacturer: ON Semiconductor/Fairchild; Designer: Abbas Basereh; Link: https://www.aliexpress.com/item/Free-shipping-100pcs-1n5822-sma-smd-do-214ac-Schottky-diode-ss34/32337482329.html?spm=2114.01010208.3.1.zLZDsP&ws_ab_test=searchweb0_0,searchweb201602_4_10065_10068_10084_10083_10080_10082_10081_10060_10061_10062_10056_10055_10054_10059_10099_10078_10079_427_10073_10103_10102_10096_10052_10050_10051,searchweb201603_4&btsid=6e50dc92-ac69-45bc-a19e-209af19ce602; Link: http://www.tme.eu/en/details/ss34/smd-schottky-diodes/vishay/ss34-e357t/; Link: http://www.digikey.com/product-detail/en/on-semiconductor-fairchild/SS34/SS34FSCT-ND/2094459; Data: 16-12-2016
D12 D16 = 1N5819HW-7-F: Diode Schottky 40 V 1A Surface Mount SOD-123; MF: Diodes Inc.; Value: *; SnapEDA_Link: https://www.snapeda.com/parts/1N5819HW-7-F/Diodes+Inc./view-part/?ref=snap; Purchase-URL: https://pricing.snapeda.com/search/part/1N5819HW-7-F/?ref=eda; Availability: In Stock; Price: None; Package: SOD-123 Fairchild Semiconductor; Check_prices: https://www.snapeda.com/parts/1N5819HW-7-F/Diodes+Inc./view-part/?ref=eda; MP: 1N5819HW-7-F
ESP_STATUS1 LED1 LED2 NET_MODE1 NET_STATUS1 STATUS1 = LED: 5V OK; Designer: Saeid Jorablo; Organazation: ControTec; Adding Date: 1387/12/22; Color: Red
F1-F3 = Fuse 5x20 with holdeer pins: Fuses 5x20; Designer: Abbas Basereh; Desc.: fuse with holder pins 5x20; Data: 28-12-2016
H1 H2 = MOUNT-HOLE: MOUNTING HOLE with drill center marker
I/O = Header 10: Header, 10-Pin; LatestRevisionDate: 17-Jul-2002; LatestRevisionNote: Re-released for DXP Platform.; Publisher: Altium Limited
L1 = INDC_2u2_1210_1200mA: Manufacturer 1: TDK Corporation; Manufacturer Part Number 1: NLCV32T-2R2M-PFR; Ratings: 1.2 Adc; Tolerance: ±20%; Type: Ferrite Core; DC Resistance (DCR): 115 mOhm; Q @ Freq: 15 @ 7.96MHz; Frequency - Self Resonant: 68MHz; Frequency - Test: 7.96MHz; SCDType: source; Package / Case: 1210 (3225 Metric); Supplier 1: Digi-Key; Supplier Part Number 1: 445-3650-1-ND; ComponentLink1URL: http://www.tdk.co.jp/tefe02/e511_nlcv_nlc.pdf; ComponentLink1Description: http://www.tdk.co.jp/tefe02/e511_nlcv_nlc.pdf; Operating Temperature: -40°C ~ 125°C; Value: 6.8NH
L2 = INDC_2u2_1210_1200mA: Inductor 2.2uH 1.2A 1210 SMD chip; Manufacturer 1: TDK Corporation; Manufacturer Part Number 1: NLCV32T-2R2M-PFR; Ratings: 1.2 Adc; Tolerance: ±20%; Type: Ferrite Core; DC Resistance (DCR): 115 mOhm; Q @ Freq: 15 @ 7.96MHz; Frequency - Self Resonant: 68MHz; Frequency - Test: 7.96MHz; SCDType: source; Package / Case: 1210 (3225 Metric); Supplier 1: Digi-Key; Supplier Part Number 1: 445-3650-1-ND; ComponentLink1URL: http://www.tdk.co.jp/tefe02/e511_nlcv_nlc.pdf; ComponentLink1Description: http://www.tdk.co.jp/tefe02/e511_nlcv_nlc.pdf; Operating Temperature: -40°C ~ 125°C
L3 = DRC-V-822K: Radial Inductor with Leads,8200ÂµH, 0.13A,Q>20; MF: Bel Fuse; MP: DRC-V-822K; Purchase-URL: https://pricing.snapeda.com/search/part/DRC-V-822K/?ref=eda; SnapEDA_Link: https://www.snapeda.com/parts/DRC-V-822K/Bel+Fuse/view-part/?ref=snap; Value: *; Package: None; Price: None; Availability: In Stock; Check_prices: https://www.snapeda.com/parts/DRC-V-822K/Bel+Fuse/view-part/?ref=eda
MAIN_ANT1 = ANT-LTE-CER-T: Cellular Multiband Monopole Ceramic Chip Antenna; MF: Linx Technologies; Value: *; Price: None; Package: None; Check_prices: https://www.snapeda.com/parts/ANT-LTE-CER-T/Linx%20Technologies%20Inc./view-part/2769557/?ref=eda; Availability: In Stock; SnapEDA_Link: https://www.snapeda.com/parts/ANT-LTE-CER-T/Linx%20Technologies%20Inc./view-part/2769557/?ref=snap; MP: ANT-LTE-CER-T
MICRO_SD1 = CON_Micro SD: Secure Digital Card Socket; Max Current: mA; designer: Eng. Saeid Jorablo; Company: SJ Libraries; Connector type: Header; Mounting Technology: Surface Mount; Status: Unreleased; Category: Connector; Pin Count: 13; Publisher: SJ UnLimited; ComponentLink1Description: Datasheet; ComponentLink2Description: Reference; Update: 7/8/2012; HelpURL: http://s3.picofile.com/file/7443264187/Coming_Soon_logo.gif
Power_12V Power_in = Header 2: Header, 2-Pin; LatestRevisionDate: 17-Jul-2002; LatestRevisionNote: Re-released for DXP Platform.; Publisher: Altium Limited
POWER_SW1 RESET_SW1 USB_BOOT_SW1 = Switch PB: Push Button Switch
PowerOut = Header 4: Header, 4-Pin; LatestRevisionDate: 17-Jul-2002; LatestRevisionNote: Re-released for DXP Platform.; Publisher: Altium Limited
Q1 Q2 = SMD-TRANSISTORS-NPN-25V-500MW(SOT-23): 305010017; Price: None; MP: S8050; Availability: Unavailable; Value: *; Package: None
Q3-Q7 = BSS138: N-Channel 50V 220mA (Ta) 360mW (Ta) Surface Mount SOT-23-3; Price: None; MP: BSS138; Value: *; Availability: Unavailable; Package: None
Q8 Q9 = BC847B: BJT, SOT-23, 45V, 100mA, NPN, 0.25W, 150C; MF: Diotec Semiconductor; SnapEDA_Link: https://www.snapeda.com/parts/BC847B/Diotec/view-part/?ref=snap; Package: SOT-23-3 Diotec; Value: *; MP: BC847B; Check_prices: https://www.snapeda.com/parts/BC847B/Diotec/view-part/?ref=eda
R1 R2 R4-R26 R28 R37-R47 R49-R51 R?#1 R?#2 = RES Axial 0.5W: Designer: Abbas Basereh; Desc.: RES Axial 0.5W; Data: 4-1-2017
R3 R48 = RES 1206 0.25W: RES 1206; Designer: Abbas Basereh; Desc.: RES SMD 1206; Data: 16-12-2016
R27 R29-R36 = 2-2176053-0: RES 0.33 OHM 1% 1/4W 0805; Power_Rating: .25 W; Resistance: .33; MF: TE Connectivity; Price: None; Availability: In Stock; EU_RoHS_Compliance: Compliant with Exemptions; Package: 0805; MP: 2-2176053-0; Value: *; Tolerance: 1%; SnapEDA_Link: https://www.snapeda.com/parts/2-2176053-0/TE+Connectivity/view-part/?ref=snap; Check_prices: https://www.snapeda.com/parts/2-2176053-0/TE+Connectivity/view-part/?ref=eda
SIM1 = SIM8051-6-0-14-00-X-REVD: Nano SIM Card Connector, Push-Pull Type, 6 Pin, SMT, Profile 1.35mm; Price: None; Value: *; MP: SIM8051-6-0-14-00-X-REVD; Package: None; Availability: Unavailable
U1 = LM2596S-3.3_NOPB: Integrated Circuit; Manufacturer_Name: Texas Instruments; Manufacturer_Part_Number: LM2596S-3.3/NOPB; Datasheet Link: http://www.ti.com/lit/ds/symlink/lm2596.pdf; Height: 4.65mm; Mouser Part Number: 926-LM2596S-3.3/NOPB; Mouser Price/Stock: https://www.mouser.co.uk/ProductDetail/Texas-Instruments/LM2596S-3.3-NOPB?qs=X1J7HmVL2ZHsEwG9Q6doow%3D%3D; Arrow Part Number: LM2596S-3.3/NOPB; Arrow Price/Stock: https://www.arrow.com/en/products/lm2596s-3.3nopb/texas-instruments?region=nac
U2 = MAX485: 1/1 Transceiver Half RS422, RS485 8-SOIC; MF: Maxim Integrated; SnapEDA_Link: https://www.snapeda.com/parts/MAX485/Maxim%20Integrated/view-part/493689/?ref=snap; Package: SOIC-8 Maxim Integrated; MP: MAX485; Value: *; Digi-Key_Part_Number: MAX485CSA+TCT-ND; Digi-Key_Purchase_URL: https://www.digikey.com/product-detail/en/maxim-integrated/MAX485CSA-T/MAX485CSA-TCT-ND/3894816?utm_source=snapeda&utm_medium=aggregator&utm_campaign=symbol
U3 = MIC29302WU-TR: Integrated Circuit; Manufacturer_Name: Microchip; Datasheet Link: http://ww1.microchip.com/downloads/en/DeviceDoc/20005685A.pdf; Height: 4.597mm; Manufacturer_Part_Number: MIC29302WU-TR; Mouser Part Number: 998-MIC29302WUTR; Mouser Price/Stock: https://www.mouser.co.uk/ProductDetail/Microchip-Technology/MIC29302WU-TR?qs=U6T8BxXiZAWR9%2FgJIuiMuA%3D%3D; Arrow Part Number: MIC29302WU-TR; Arrow Price/Stock: https://www.arrow.com/en/products/mic29302wu-tr/microchip-technology?region=nac
U4 = SM712: 31V, 19V Clamp 19A _8/20Âµs_ Ipp Tvs Diode Surface Mount SOT-23-3; MF: Semtech; Package: SOT-23 Semtech; Price: None; Value: *; MP: SM712; SnapEDA_Link: https://www.snapeda.com/parts/SM712/Semtech/view-part/4219095/?ref=snap; Availability: Unavailable
U5 = ESP32-C6-WROOM-1-N8: Multiprotocol Modules ESP32-C6 module, Wi-Fi 6 in 2.4 GHz band, Bluetooth 5, Zigbee 3.0 and Thread. ESP34-WROOM Compatible - ENGINEERING SAMPLE; MF: Espressif Systems; SnapEDA_Link: https://www.snapeda.com/parts/ESP32-C6-WROOM-1-N8/Espressif+Systems/view-part/?ref=snap; Package: None; Value: *; MP: ESP32-C6-WROOM-1-N8; Check_prices: https://www.snapeda.com/parts/ESP32-C6-WROOM-1-N8/Espressif+Systems/view-part/?ref=eda
U6 = TXS0108EPWR: 8-bit bidirectional voltage-level shifter for open-drain and push-pull application; MF: Texas Instruments; Value: *; SnapEDA_Link: https://www.snapeda.com/parts/TXS0108EPWR/Texas+Instruments/view-part/?ref=snap; Purchase-URL: https://pricing.snapeda.com/search/part/TXS0108EPWR/?ref=eda; Availability: In Stock; Price: None; Package: TSSOP-20 Texas Instruments; Check_prices: https://www.snapeda.com/parts/TXS0108EPWR/Texas+Instruments/view-part/?ref=eda; MP: TXS0108EPWR
U7 = EC200UCNAA-N05-SGNSA: Integrated Circuit; Manufacturer_Name: Quectel; Datasheet Link: https://www.evelta.com/content/datasheets/027-EC200UCNAA.pdf; Height: 2.6mm; Manufacturer_Part_Number: EC200UCNAA-N05-SGNSA; Mouser Part Number: 277-EC2UCNAAN05SGNSA; Mouser Price/Stock: https://www.mouser.co.uk/ProductDetail/Quectel/EC200UCNAA-N05-SGNSA?qs=vvQtp7zwQdNfIz65%252BTj4jQ%3D%3D
U8 = CH340: CH340 USB 2.0 to UART Interface Evaluation Board; MF: DFRobot; Value: *; Price: None; Package: None; SnapEDA_Link: https://www.snapeda.com/parts/CH340/DFRobot/view-part/53354/?ref=snap; Availability: Unavailable; MP: CH340
USB1 USB2 = 10155435-00011LF: MF: Amphenol ICC (FCI); Package: None; Price: None; Value: *; MP: 10155435-00011LF; Availability: Unavailable
Y1 = XTAL: XTAL Crystal; Designer: ABBAS BASEREH; Design Date: 2017-1-3; ComponentLink1Description: Datasheet; ComponentLink2Description: Reference; Mounting Technology: Surface Mount\Through-Hole; Value: 12 MHz; Status: Unreleased